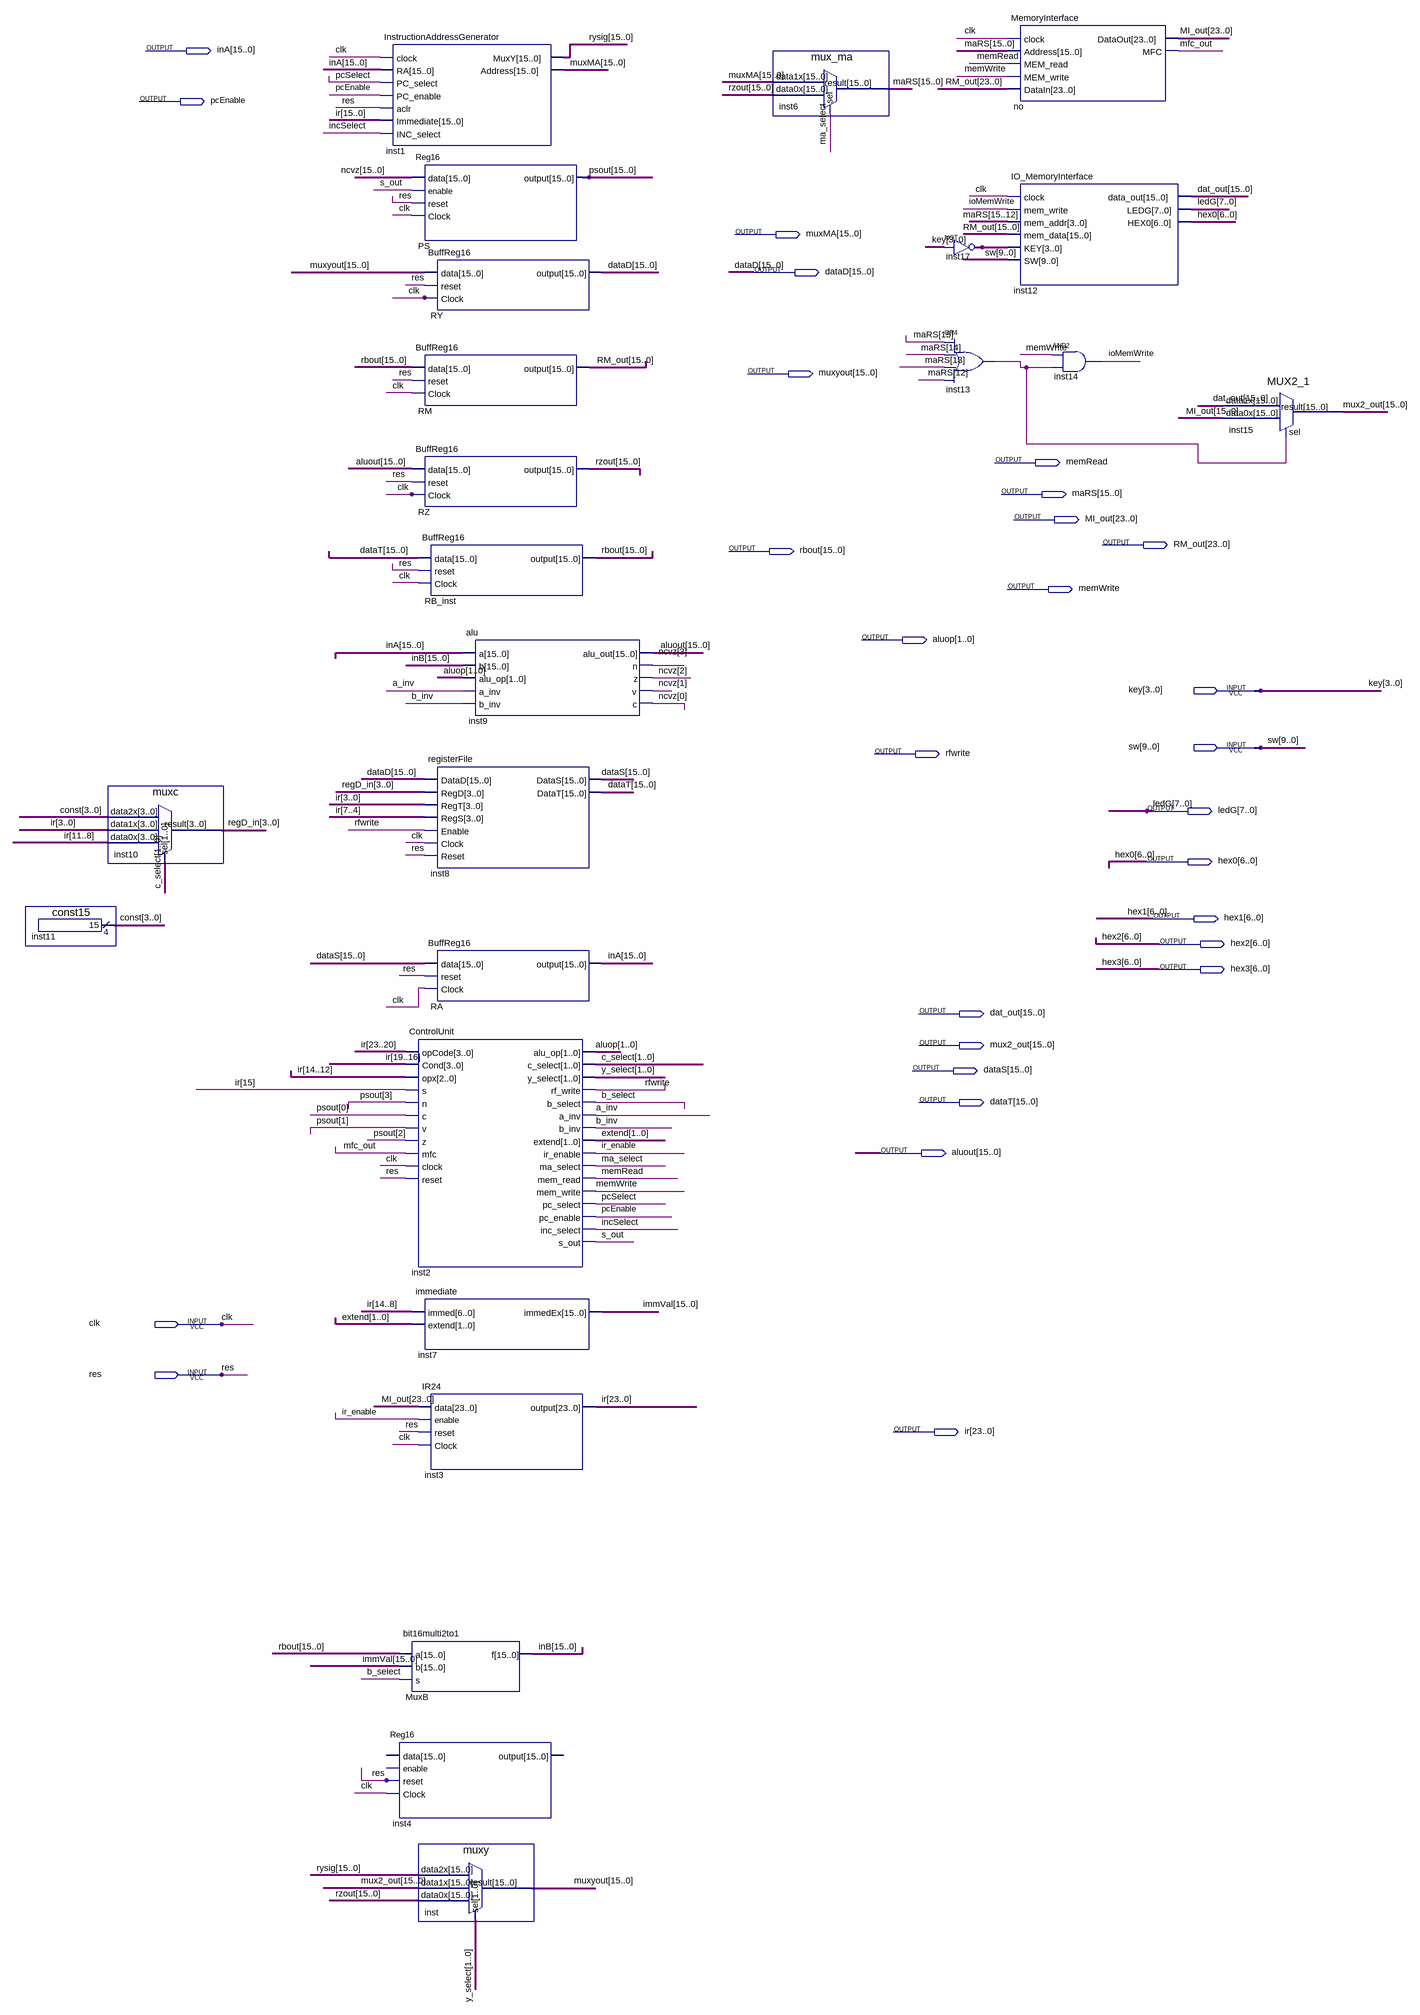
[diagram p0: schematic sheet]
// Quartus schematic project.bdf as structural Verilog: 24 symbols, 28 pins
module project (
  input  [3:0] key,
  input  [9:0] sw,
  input  clk,
  input  res,
  output [15:0] inA,
  output pcEnable,
  output [15:0] muxMA,
  output [15:0] dataD,
  output [15:0] muxyout,
  output memRead,
  output [15:0] maRS,
  output [23:0] MI_out,
  output [23:0] RM_out,
  output [15:0] rbout,
  output memWrite,
  output [1:0] aluop,
  output rfwrite,
  output [7:0] ledG,
  output [6:0] hex0,
  output [6:0] hex1,
  output [6:0] hex2,
  output [6:0] hex3,
  output [15:0] dat_out,
  output [15:0] mux2_out,
  output [15:0] dataS,
  output [15:0] dataT,
  output [15:0] aluout,
  output [23:0] ir
);

  wire a_inv, b_inv, b_select, incSelect, inst13_out, ioMemWrite, ir_enable, ma_select, mfc_out, pcSelect,
       s_out;
  wire [1:0] c_select, extend, y_select;
  wire [3:0] \const , inst17_out, regD_in;
  wire [15:0] immVal, inB, ncvz, psout, rysig, rzout;

  const15 inst11 (.result(\const ));
  muxc inst10 (.data2x(\const ), .data1x(ir[3:0]), .data0x(ir[11:8]), .sel(c_select), .result(regD_in));
  InstructionAddressGenerator inst1 (
    .clock(clk), .RA(inA), .PC_select(pcSelect), .PC_enable(pcEnable), .aclr(res), .Immediate(ir[15:0]),
    .INC_select(incSelect), .MuxY(rysig), .Address(muxMA));
  Reg16 inst4 (.reset(res), .Clock(clk));  // open: data, enable, output
  Reg16 PS (.data(ncvz), .enable(s_out), .reset(res), .Clock(clk), .\output (psout));
  BuffReg16 RY (.data(muxyout), .reset(res), .Clock(clk), .\output (dataD));
  BuffReg16 RM (.data(rbout), .reset(res), .Clock(clk), .\output (RM_out[15:0]));
  BuffReg16 RZ (.data(aluout), .reset(res), .Clock(clk), .\output (rzout));
  BuffReg16 RB_inst (.data(dataT), .reset(res), .Clock(clk), .\output (rbout));
  registerFile inst8 (
    .DataD(dataD), .RegD(regD_in), .RegT(ir[3:0]), .RegS(ir[7:4]), .Enable(rfwrite), .Clock(clk),
    .Reset(res), .DataS(dataS), .DataT(dataT));
  BuffReg16 RA (.data(dataS), .reset(res), .Clock(clk), .\output (inA));
  ControlUnit inst2 (
    .opCode(ir[23:20]), .Cond(ir[19:16]), .opx(ir[14:12]), .s(ir[15]), .n(psout[3]), .c(psout[0]),
    .v(psout[1]), .z(psout[2]), .mfc(mfc_out), .clock(clk), .reset(res), .alu_op(aluop), .c_select(c_select),
    .y_select(y_select), .rf_write(rfwrite), .b_select(b_select), .a_inv(a_inv), .b_inv(b_inv),
    .extend(extend), .ir_enable(ir_enable), .ma_select(ma_select), .mem_read(memRead), .mem_write(memWrite),
    .pc_select(pcSelect), .pc_enable(pcEnable), .inc_select(incSelect), .s_out(s_out));
  immediate inst7 (.immed(ir[14:8]), .extend(extend), .immedEx(immVal));
  IR24 inst3 (.data(MI_out), .enable(ir_enable), .reset(res), .Clock(clk), .\output (ir));
  bit16multi2to1 MuxB (.a(rbout), .b(immVal), .s(b_select), .f(inB));
  muxy inst (.data2x(rysig), .data1x(mux2_out), .data0x(rzout), .sel(y_select), .result(muxyout));
  alu inst9 (
    .a(inA), .b(inB), .alu_op(aluop), .a_inv(a_inv), .b_inv(b_inv), .alu_out(aluout), .n(ncvz[3]),
    .z(ncvz[2]), .v(ncvz[1]), .c(ncvz[0]));
  mux_ma inst6 (.data1x(muxMA), .data0x(rzout), .sel(ma_select), .result(maRS));
  assign inst17_out = ~key;  // NOT inst17, 4 bits wide
  or inst13 (inst13_out, maRS[15], maRS[14], maRS[13], maRS[12]);
  MemoryInterface no (
    .clock(clk), .Address(maRS), .MEM_read(memRead), .MEM_write(memWrite), .DataIn(RM_out), .DataOut(MI_out),
    .MFC(mfc_out));
  IO_MemoryInterface inst12 (
    .clock(clk), .mem_write(ioMemWrite), .mem_addr(maRS[15:12]), .mem_data(RM_out[15:0]), .KEY(inst17_out),
    .SW(sw), .data_out(dat_out), .LEDG(ledG), .HEX0(hex0));
  and inst14 (ioMemWrite, memWrite, inst13_out);
  MUX2_1 inst15 (.data1x(dat_out), .data0x(MI_out[15:0]), .sel(inst13_out), .result(mux2_out));
endmodule
